# EAGLE design E-P-099-R3.0 (EAGLE 9.0.1)
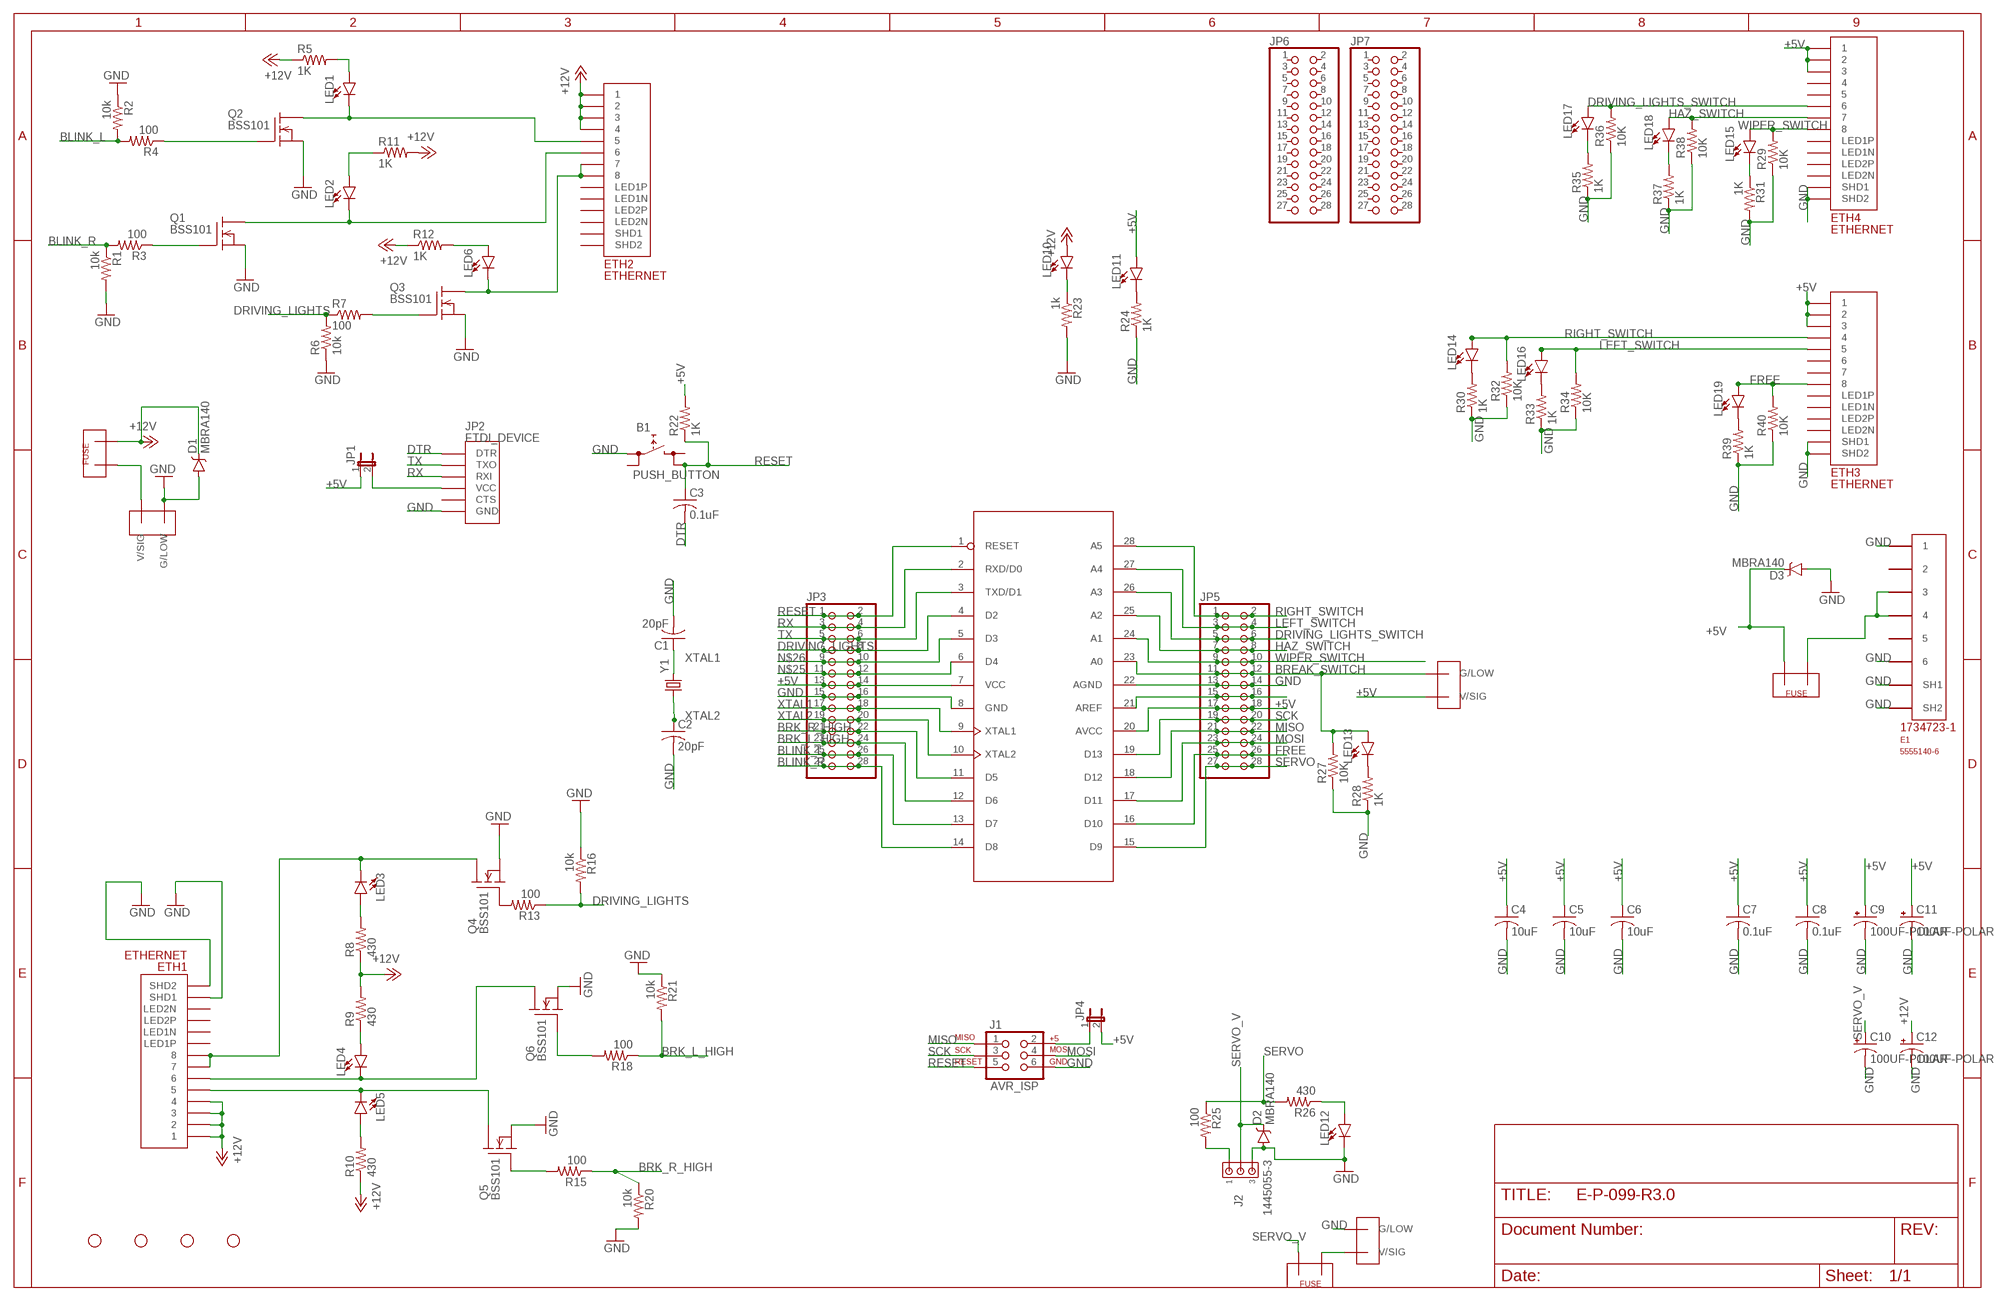
[diagram p0: schematic, sheet 1]

## Parts
AT1  ATMEGA328  [DIP28-0.3IN]
B1  PUSH_BUTTON  [PUSHBUTTON]
C1  20pF  C-USC0805  [C0805]
C2  20pF  C-USC0805  [C0805]
C3  0.1uF  C-USC0805  [C0805]
C4  10uF  C-USC0805  [C0805]
C5  10uF  C-USC0805  [C0805]
C6  10uF  C-USC0805  [C0805]
C7  0.1uF  C-USC0805  [C0805]
C8  0.1uF  C-USC0805  [C0805]
C9  100UF-POLAR  [EEU-FR1H101]
C10  100UF-POLAR  [EEU-FR1H101]
C11  100UF-POLAR  [EEU-FR1H101]
C12  100UF-POLAR  [EEU-FR1H101]
D1  MBRA140  [SMA-DIODE]
D2  MBRA140  [SMA-DIODE]
D3  MBRA140  [SMA-DIODE]
E1  5555140-6  [1734723-1_RJ11]
ETH1  ETHERNET  [A122645-ND]
ETH2  ETHERNET  [A122645-ND]
ETH3  ETHERNET  [A122645-ND]
ETH4  ETHERNET  [A122645-ND]
F1  FUSEMINI-BLADE  [MINI-BLADE-FUSE]
F2  FUSEMINI-BLADE  [MINI-BLADE-FUSE]
F3  FUSEMINI-BLADE  [MINI-BLADE-FUSE]
J1  AVR_ISP  AVR_SPI_PRG_6PTH  [2X3]
J2  1445055-3  [1445055-3]
JP1  JP1E  [JP1]
JP2  FTDI_DEVICE  [FTDI_DEVICE_SIDE]
JP3  PINHD-2X14  [2X14]
JP4  JP1E  [JP1]
JP5  PINHD-2X14  [2X14]
JP6  PINHD-2X14  [2X14]
JP7  PINHD-2X14  [2X14]
LED1  LED0603  [LED-0603]
LED2  LED0603  [LED-0603]
LED3  LED0603  [LED-0603]
LED4  LED0603  [LED-0603]
LED5  LED0603  [LED-0603]
LED6  LED0603  [LED-0603]
LED10  LED0603  [LED-0603]
LED11  LED0603  [LED-0603]
LED12  LED0603  [LED-0603]
LED13  LED0603  [LED-0603]
LED14  LED0603  [LED-0603]
LED15  LED0603  [LED-0603]
LED16  LED0603  [LED-0603]
LED17  LED0603  [LED-0603]
LED18  LED0603  [LED-0603]
LED19  LED0603  [LED-0603]
Q1  BSS101  [TO92]
Q2  BSS101  [TO92]
Q3  BSS101  [TO92]
Q4  BSS101  [TO92]
Q5  BSS101  [TO92]
Q6  BSS101  [TO92]
R1  10k  RESISTOR0805-RES  [0805]
R2  10k  RESISTOR0805-RES  [0805]
R3  100  RESISTOR0805-RES  [0805]
R4  100  RESISTOR0805-RES  [0805]
R5  1K  RESISTOR0805-RES  [0805]
R6  10k  RESISTOR0805-RES  [0805]
R7  100  RESISTOR0805-RES  [0805]
R8  430  RESISTOR0805-RES  [0805]
R9  430  RESISTOR0805-RES  [0805]
R10  430  RESISTOR0805-RES  [0805]
R11  1K  RESISTOR0805-RES  [0805]
R12  1K  RESISTOR0805-RES  [0805]
R13  100  RESISTOR0805-RES  [0805]
R15  100  RESISTOR0805-RES  [0805]
R16  10k  RESISTOR0805-RES  [0805]
R18  100  RESISTOR0805-RES  [0805]
R20  10k  RESISTOR0805-RES  [0805]
R21  10k  RESISTOR0805-RES  [0805]
R22  1K  RESISTOR0805-RES  [0805]
R23  1k  RESISTOR0805-RES  [0805]
R24  1K  RESISTOR0805-RES  [0805]
R25  100  RESISTOR0805-RES  [0805]
R26  430  RESISTOR0805-RES  [0805]
R27  10K  R-US_R0805  [R0805]
R28  1K  RESISTOR0805-RES  [0805]
R29  10K  R-US_R0805  [R0805]
R30  1K  RESISTOR0805-RES  [0805]
R31  1K  RESISTOR0805-RES  [0805]
R32  10K  R-US_R0805  [R0805]
R33  1K  RESISTOR0805-RES  [0805]
R34  10K  R-US_R0805  [R0805]
R35  1K  RESISTOR0805-RES  [0805]
R36  10K  R-US_R0805  [R0805]
R37  1K  RESISTOR0805-RES  [0805]
R38  10K  R-US_R0805  [R0805]
R39  1K  RESISTOR0805-RES  [0805]
R40  10K  R-US_R0805  [R0805]
STANDOFF1  STAND-OFF  [STAND-OFF]
STANDOFF2  STAND-OFF  [STAND-OFF]
STANDOFF3  STAND-OFF  [STAND-OFF]
STANDOFF4  STAND-OFF  [STAND-OFF]
TE1  TE770966  [2X1-MATE-N-LOCK]
TE2  SERVO_PWR  TE770966  [2X1-MATE-N-LOCK]
TE3  TE770966  [2X1-MATE-N-LOCK]
Y1  CRYSTALHC49US  [HC49US]

## Nets
+5V: AT1.7(VCC) AT1.20(AVCC) C4.1 C5.1 C6.1 C7.1 C8.1 C9.P(+) C11.P(+) D3.C ETH3.P$1 ETH3.P$2 ETH3.P$3 ETH4.P$1 ETH4.P$2 ETH4.P$3 F3.OUT JP1.1 JP3.13 JP3.14 JP4.2 JP5.17 JP5.18 LED11.A R22.2 TE3.CIRCUIT1(V/SIG)
+12V: C12.P(+) D1.C ETH1.P$1 ETH1.P$2 ETH1.P$3 ETH1.P$4 ETH2.P$1 ETH2.P$2 ETH2.P$3 ETH2.P$4 F1.OUT LED10.A R5.1 R8.1 R9.2 R10.1 R11.2 R12.1
BLINK_L: AT1.13(D7) JP3.25 JP3.26 R2.2 R4.2
BLINK_R: AT1.14(D8) JP3.27 JP3.28 R1.1 R3.2
BREAK_SWITCH: AT1.23(A0) JP5.11 JP5.12 LED13.A R27.2 TE3.CIRCUIT2(G/LOW)
BRK_L_HIGH: AT1.12(D6) JP3.23 JP3.24 R18.1 R21.2
BRK_R_HIGH: AT1.11(D5) JP3.21 JP3.22 R15.1 R20.1
DRIVING_LIGHTS: AT1.4(D2) JP3.7 JP3.8 R6.2 R7.1 R13.1 R16.2
DRIVING_LIGHTS_SWITCH: AT1.26(A3) ETH4.P$6 JP5.5 JP5.6 LED17.A R36.2
DTR: C3.2 JP2.P$1(DTR)
FREE: AT1.16(D10) ETH3.P$8 JP5.25 JP5.26 LED19.A R40.2
GND: AT1.8(GND) AT1.22(AGND) B1.L1(L) C1.2 C2.2 C4.2 C5.2 C6.2 C7.2 C8.2 C9.G(-) C10.G(-) C11.G(-) C12.G(-) D1.A D2.A D3.A E1.1 E1.6 E1.SH1 E1.SH2 ETH1.P$13(SHD1) ETH1.P$14(SHD2) ETH3.P$13(SHD1) ETH3.P$14(SHD2) ETH4.P$13(SHD1) ETH4.P$14(SHD2) J1.6 J2.3 JP2.P$6(GND) JP3.15 JP3.16 JP5.13 JP5.14 LED12.C Q1.1(S) Q2.1(S) Q3.1(S) Q4.1(S) Q5.1(S) Q6.1(S) R1.2 R2.1 R6.1 R16.1 R20.2 R21.1 R23.2 R24.1 R27.1 R28.1 R29.1 R30.1 R31.2 R32.1 R33.1 R34.1 R35.1 R36.1 R37.1 R38.1 R39.1 R40.1 TE1.CIRCUIT2(G/LOW) TE2.CIRCUIT2(G/LOW)
HAZ_SWITCH: AT1.25(A2) ETH4.P$7 JP5.7 JP5.8 LED18.A R38.2
LEFT_SWITCH: AT1.27(A4) ETH3.P$5 JP5.3 JP5.4 LED16.A R34.2
MISO: AT1.18(D12) J1.1 JP5.21 JP5.22
MOSI: AT1.17(D11) J1.4 JP5.23 JP5.24
N$1: LED14.C R30.2
N$2: LED17.C R35.2
N$3: LED16.C R33.2
N$4: ETH1.P$7 ETH1.P$8 LED3.C Q4.3(D)
N$5: ETH1.P$6 LED4.C Q6.3(D)
N$6: E1.3 E1.4 F3.IN
N$7: ETH1.P$5 LED5.C Q5.3(D)
N$8: Q4.2(G) R13.2
N$9: JP1.2 JP2.P$4(VCC)
N$10: LED19.C R39.2
N$11: LED13.C R28.2
N$12: LED12.A R26.1
N$13: J2.1 R25.2
N$14: Q5.2(G) R15.2
N$15: Q6.2(G) R18.2
N$16: LED10.C R23.1
N$17: Q2.2(G) R4.1
N$18: LED5.A R10.2
N$19: LED11.C R24.2
N$20: ETH2.P$7 ETH2.P$8 LED6.C Q3.3(D)
N$21: ETH2.P$6 LED2.C Q1.3(D)
N$22: ETH2.P$5 LED1.C Q2.3(D)
N$23: LED4.A R9.1
N$25: AT1.6(D4) JP3.11 JP3.12
N$26: AT1.5(D3) JP3.9 JP3.10
N$27: LED3.A R8.2
N$28: LED15.C R31.1
N$29: F2.IN TE2.CIRCUIT1(V/SIG)
N$32: LED1.A R5.2
N$33: Q1.2(G) R3.1
N$34: LED2.A R11.1
N$35: Q3.2(G) R7.2
N$36: LED6.A R12.2
N$37: J1.2 JP4.1
N$46: LED18.C R37.2
N$47: F1.IN TE1.CIRCUIT1(V/SIG)
N$60: AT1.21(AREF) JP5.15 JP5.16
RESET: AT1.1(RESET) B1.R2(R) C3.1 J1.5 JP3.1 JP3.2 R22.1
RIGHT_SWITCH: AT1.28(A5) ETH3.P$4 JP5.1 JP5.2 LED14.A R32.2
RX: AT1.2(RXD/D0) JP2.P$3(RXI) JP3.3 JP3.4
SCK: AT1.19(D13) J1.3 JP5.19 JP5.20
SERVO: AT1.15(D9) JP5.27 JP5.28 R25.1 R26.2
SERVO_V: C10.P(+) D2.C F2.OUT J2.2
TX: AT1.3(TXD/D1) JP2.P$2(TXO) JP3.5 JP3.6
WIPER_SWITCH: AT1.24(A1) ETH4.P$8 JP5.9 JP5.10 LED15.A R29.2
XTAL1: AT1.9(XTAL1) C1.1 JP3.17 JP3.18 Y1.2
XTAL2: AT1.10(XTAL2) C2.1 JP3.19 JP3.20 Y1.1
Unconnected: B1.L2(L) B1.R1(R) E1.2 E1.5 ETH1.P$9(LED1N) ETH1.P$10(LED1P) ETH1.P$11(LED2N) ETH1.P$12(LED2P) ETH2.P$9(LED1N) ETH2.P$10(LED1P) ETH2.P$11(LED2N) ETH2.P$12(LED2P) ETH2.P$13(SHD1) ETH2.P$14(SHD2) ETH3.P$6 ETH3.P$7 ETH3.P$9(LED1N) ETH3.P$10(LED1P) ETH3.P$11(LED2N) ETH3.P$12(LED2P) ETH4.P$4 ETH4.P$5 ETH4.P$9(LED1N) ETH4.P$10(LED1P) ETH4.P$11(LED2N) ETH4.P$12(LED2P) JP2.P$5(CTS) JP6.1 JP6.2 JP6.3 JP6.4 JP6.5 JP6.6 JP6.7 JP6.8 JP6.9 JP6.10 JP6.11 JP6.12 JP6.13 JP6.14 JP6.15 JP6.16 JP6.17 JP6.18 JP6.19 JP6.20 JP6.21 JP6.22 JP6.23 JP6.24 JP6.25 JP6.26 JP6.27 JP6.28 JP7.1 JP7.2 JP7.3 JP7.4 JP7.5 JP7.6 JP7.7 JP7.8 JP7.9 JP7.10 JP7.11 JP7.12 JP7.13 JP7.14 JP7.15 JP7.16 JP7.17 JP7.18 JP7.19 JP7.20 JP7.21 JP7.22 JP7.23 JP7.24 JP7.25 JP7.26 JP7.27 JP7.28

## Library data of the parts
AT1 = atmega328p:ATMEGA328
B1 = PushButton:PUSH_BUTTON
C1-C8 = adafruit:C-US: CAPACITOR, American symbol
C9-C12 = 100uF_Cap:100UF-POLAR: 100µF polarized capacitors A capacitor is a passive two-terminal electrical component used to store electrical energy temporarily in an electric field.
D1-D3 = SparkFun-DiscreteSemi:MBRA140: 40V, 1A Schottky rectifier SMA/DO-214AC package DIO-08053; PROD_ID: DIO-08053
E1 = 5555140-6 RJ11:5555140-6
ETH1-ETH4 = ETHERNET-3:ETHERNET: Ethernet port with 2 leds. digikey number A122645-ND
F1-F3 = Fuse:FUSE
J1 = E-P-099-R2.2:AVR_SPI_PRG_6: AVR ISP 6 Pin This is the reduced ISP connector for AVR programming. Common on Arduino. This footprint will take up less PCB space and can be used with a 10-pin to 6-pin adapter such as SKU: BOB-08508
J2 = con-amp:1445055-3: Micro MATE-N-LOK Connectors grid 1.5 mm Source: ENG_CD_1445055_A.pdf
JP1 JP4 = E-P-099-R2.2:JP1E: JUMPER
JP2 = SparkFun-Connectors:FTDI_DEVICE: Connector which mates to FTDI basic or FTDI cable.
JP3 JP5-JP7 = E-P-099-R2.2:PINHD-2X14: PIN HEADER
LED1-LED6 LED10-LED19 = SparkFun-LED:LED: LED (Generic) Standard schematic elements and footprints for 5mm, 3mm, 1206, and 0603 sized LEDs. Generic LEDs with no color specified.
Q1-Q6 = transistor-fet:BSS101: N-Channel Enhancement MOSFET 200V; 0,16A; 11Ohm
R1-R13 R15 R16 R18 R20-R26 R28 R30 R31 R33 R35 R37 R39 = SparkFun-Passives:RESISTOR: Resistor Basic schematic elements and footprints for 0603, 1206, and PTH resistors.
R27 R29 R32 R34 R36 R38 R40 = resistor:R-US_: RESISTOR, American symbol
STANDOFF1-STANDOFF4 = SparkFun-Electromechanical:STAND-OFF: #4 Stand Off This is the mechanical footprint for a #4 phillips button head screw. Use the keepout ring to avoid running the screw head into surrounding components. SKU : PRT-00447
TE1-TE3 = TwoPinWhiteTEConnector:TE770966
Y1 = SparkFun-FreqCtrl:CRYSTAL: Various standard crystals. Proven footprints.

## Board
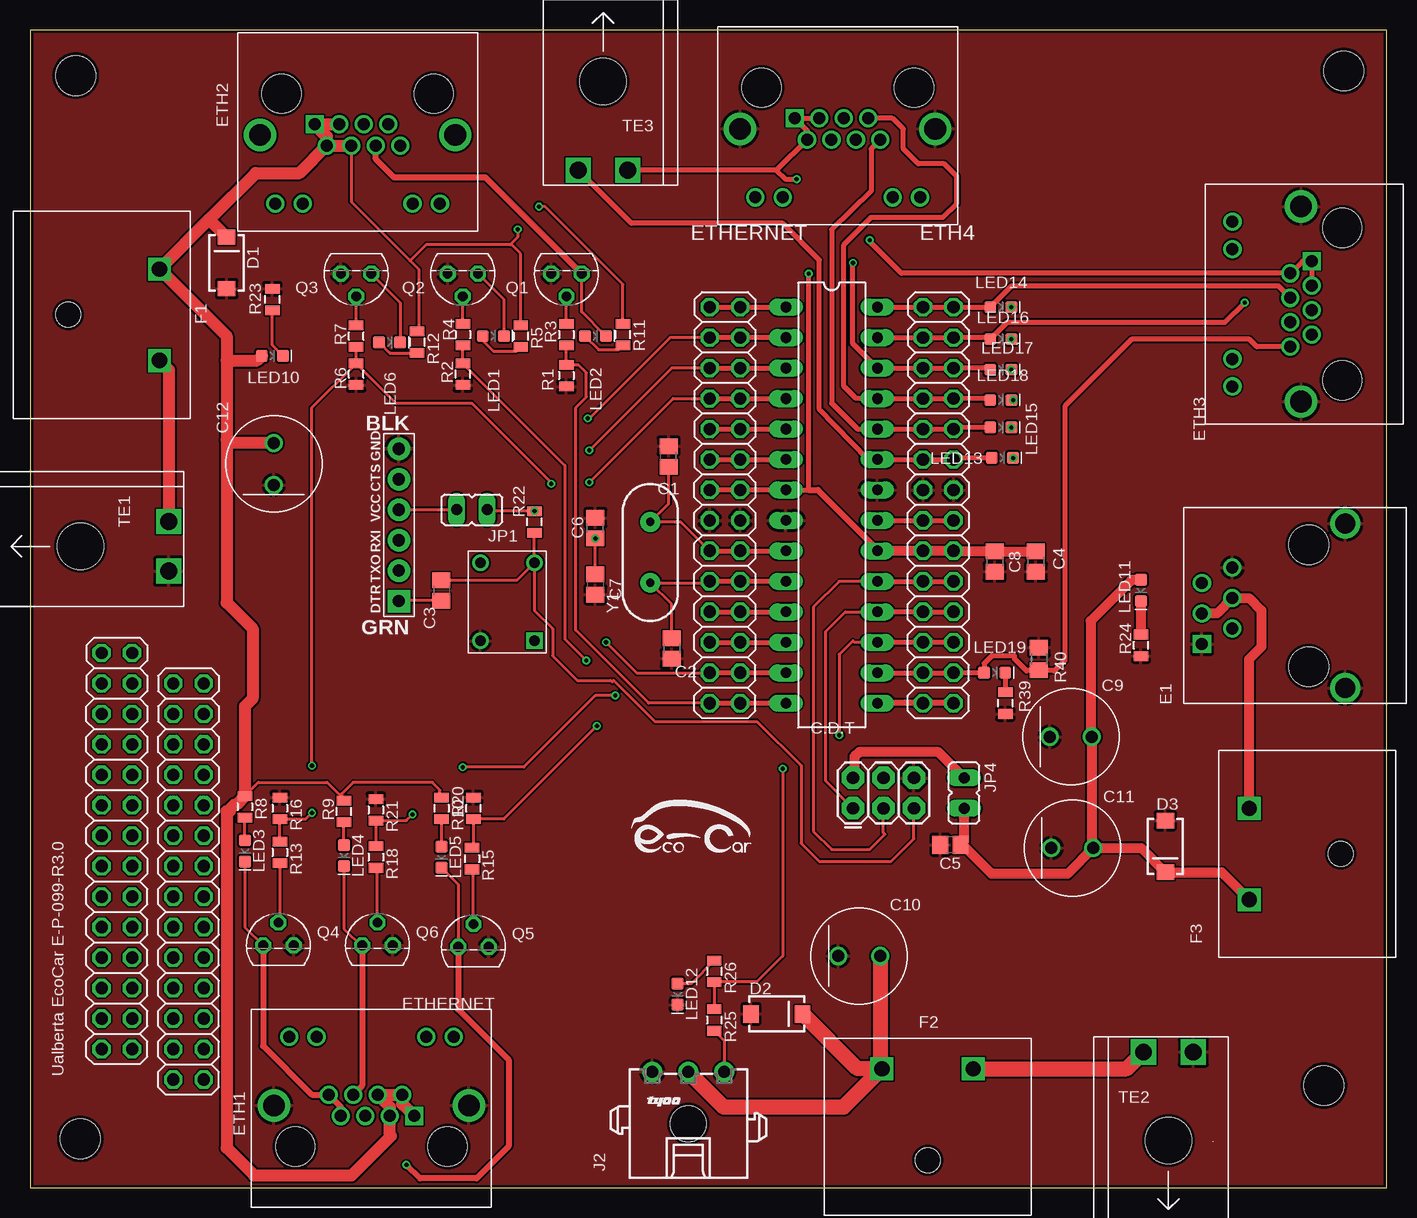
[diagram p1: board, top side]
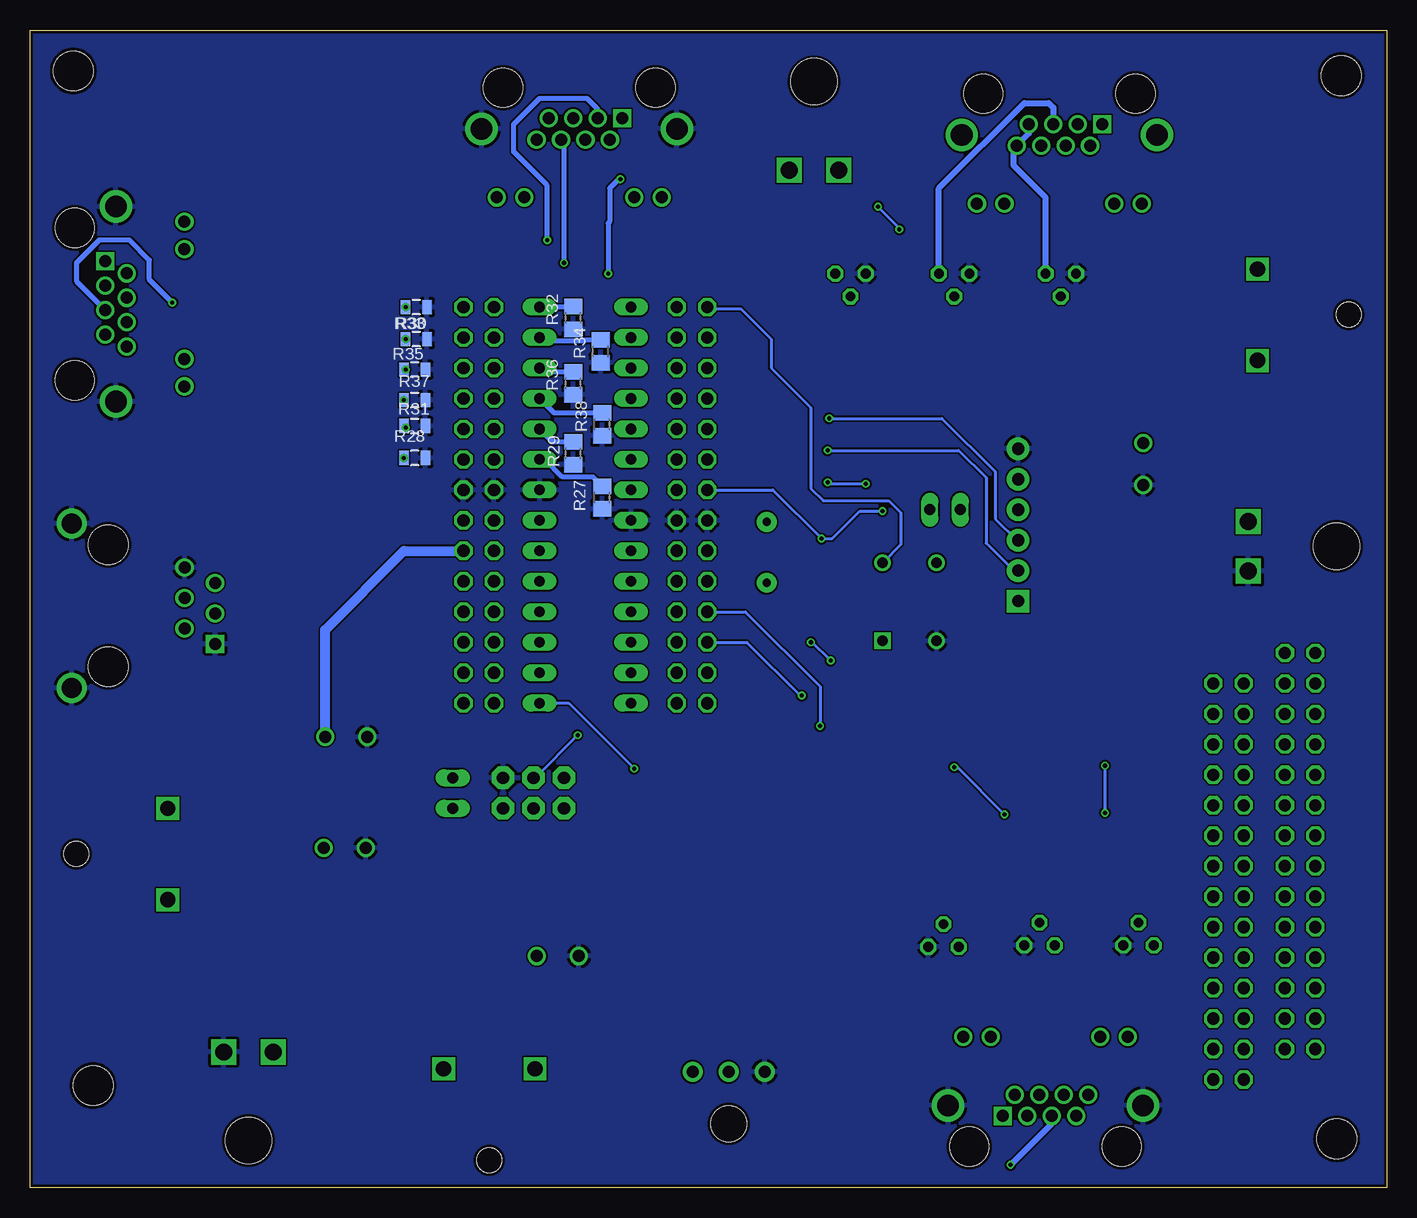
[diagram p2: board, bottom side, seen from below]

Size 113.08 x 96.51 mm. Coordinates in mm from the lower left corner, seen from the top.
Outline: 0,0 113.08,0 113.08,96.51 0,96.51 0,0
Copper layers (1*16): Top 0.035mm / dielectric 1.5mm / Bottom 0.035mm
Design rules "SeeedStudio_2layer_DRU_no_angle_20140221": minimum track width 6mil, minimum drill 12mil, track to track 6mil, track to pad 6mil, pad to pad 6mil, via to via 6mil, smd to smd 0mil, copper to edge 10mil, drill to drill 10mil, minimum pad ring 10mil, minimum via ring 6mil, stop-mask expansion 2mil, vias tented up to drill 100mil, thermal gap 10mil

### Footprints (pad centres in the part's own frame; a part is rotated, then mirrored left to right if it is on the bottom)
DIP28-0.3IN = drill 0.889 long: 1 -16.51,-3.81; 2 -13.97,-3.81; 3 -11.43,-3.81; 4 -8.89,-3.81; 5 -6.35,-3.81; 6 -3.81,-3.81; 7 -1.27,-3.81; 8 1.27,-3.81; 9 3.81,-3.81; 10 6.35,-3.81; 11 8.89,-3.81; 12 11.43,-3.81; 13 13.97,-3.81; 14 16.51,-3.81; 15 16.51,3.81; 16 13.97,3.81; 17 11.43,3.81; 18 8.89,3.81; 19 6.35,3.81; 20 3.81,3.81; 21 1.27,3.81; 22 -1.27,3.81; 23 -3.81,3.81; 24 -6.35,3.81; 25 -8.89,3.81; 26 -11.43,3.81; 27 -13.97,3.81; 28 -16.51,3.81
PUSHBUTTON = drill 0.889: L1 0,4.5; R1 6.5,4.5; R2 6.5,0 | drill 0.889 square: L2 0,0
C0805 = smd 1.3 x 1.5: 1 -0.85,0; 2 0.85,0
EEU-FR1H101 = drill 1: G -1.75,0; P 1.75,0
SMA-DIODE = smd 1.27 x 1.47: A -2.15,0; C 2.15,0
1734723-1_RJ11 = drill 1 square: 1 -3.81,2.54 | drill 1: 2 -2.54,0; 3 -1.27,2.54; 4 0,0; 5 1.27,2.54; 6 2.54,0 | drill 1.65: SH1 -7.5,-9.4; SH2 6.22,-9.4 | hole 3.3: -5.72,-6.35; 4.44,-6.35
A122645-ND = drill 1 square: P$1 3.58,2.54 | drill 1: P$2 2.56,4.32; P$3 1.54,2.54; P$4 0.52,4.32; P$5 -0.5,2.54; P$6 -1.52,4.32; P$7 -2.54,2.54; P$8 -3.56,4.32; P$9 -6.86,9.14; P$10 -4.57,9.14; P$11 4.57,9.14; P$12 6.86,9.14 | drill 1.8: P$13 -8.13,3.43; P$14 8.13,3.43 | hole 3.25: -6.35,0; 6.35,0
MINI-BLADE-FUSE = drill 1.27 square: IN 3.81,7.62; OUT -3.81,7.62 | hole 2.083: 0,0
2X3 = drill 1.016 pad 1.88 octagon: 1 0,0; 2 0,2.54; 3 2.54,0; 4 2.54,2.54; 5 5.08,0; 6 5.08,2.54
1445055-3 = drill 1 pad 1.676: 1 3,4.32; 2 0,4.32; 3 -3,4.32 | hole 3: 0,0
JP1 = drill 0.914 long: 1 0,-1.27; 2 0,1.27
FTDI_DEVICE_SIDE = drill 1.016 pad 1.88 square: P$1 -6.35,0 | drill 1.016 pad 1.88: P$2 -3.81,0; P$3 -1.27,0; P$4 1.27,0; P$5 3.81,0; P$6 6.35,0
2X14 = drill 1.016 octagon: 1 -16.51,-1.27; 2 -16.51,1.27; 3 -13.97,-1.27; 4 -13.97,1.27; 5 -11.43,-1.27; 6 -11.43,1.27; 7 -8.89,-1.27; 8 -8.89,1.27; 9 -6.35,-1.27; 10 -6.35,1.27; 11 -3.81,-1.27; 12 -3.81,1.27; 13 -1.27,-1.27; 14 -1.27,1.27; 15 1.27,-1.27; 16 1.27,1.27; 17 3.81,-1.27; 18 3.81,1.27; 19 6.35,-1.27; 20 6.35,1.27; 21 8.89,-1.27; 22 8.89,1.27; 23 11.43,-1.27; 24 11.43,1.27; 25 13.97,-1.27; 26 13.97,1.27; 27 16.51,-1.27; 28 16.51,1.27
LED-0603 = smd 1 x 1: A -0.877,0; C 0.877,0
TO92 = drill 0.813 octagon: 1 1.27,0; 2 0,1.905; 3 -1.27,0
0805 = smd 0.8 x 1.2: 1 -0.9,0; 2 0.9,0
R0805 = smd 1.3 x 1.5: 1 -0.95,0; 2 0.95,0
STAND-OFF = hole 3.302: 0,0
2X1-MATE-N-LOCK = drill 1.4 square: CIRCUIT1 -2.07,14.23; CIRCUIT2 2.07,14.23 | hole 3.86: 0,6.86
HC49US = drill 0.7 pad 1.651: 1 -2.54,0; 2 2.54,0

### Placement (x,y rotation side)
AT1  66.8,56.9 270 top
B1  42.04,45.59 90 top
C1  53.21,60.96 90 top
C2  53.47,44.96 270 top
C3  34.29,49.78 270 top
C4  83.82,52.2 270 top
C5  76.71,28.57 180 top
C6  47.12,54.99 90 top
C7  47.12,50.29 270 top
C8  80.39,52.2 270 top
C9  86.74,37.59 0 top
C10  69.09,19.3 0 top
C11  86.87,28.32 0 top
C12  20.32,60.33 90 top
D1  16.38,77.09 90 top
D2  62.23,14.48 0 top
D3  94.61,28.45 270 top
E1  100.2,49.15 90 top
ETH1  28.45,3.43 0 top
ETH2  27.3,91.19 180 top
ETH3  109.35,73.66 90 top
ETH4  67.31,91.69 180 top
F1  3.17,72.77 270 top
F2  74.8,2.29 0 top
F3  109.22,27.81 90 top
J1  68.58,31.62 0 top
J2  54.86,5.33 0 top
JP1  36.83,56.52 90 top
JP2  30.73,55.24 90 top
JP3  57.91,56.9 270 top
JP4  77.85,32.89 180 top
JP5  75.69,56.9 270 top
JP6  13.21,25.53 90 top
JP7  7.24,28.07 90 top
LED1  38.61,70.99 0 top
LED2  47.12,70.99 0 top
LED3  17.91,28.07 270 top
LED4  26.16,27.69 270 top
LED5  34.29,27.56 270 top
LED6  29.97,70.48 0 top
LED10  20.19,69.34 0 top
LED11  92.58,49.78 270 top
LED12  53.98,16.13 270 top
LED13  81.03,60.83 0 top
LED14  80.9,73.41 0 top
LED15  80.9,63.37 0 top
LED16  80.9,70.74 0 top
LED17  80.9,68.2 0 top
LED18  80.9,65.66 0 top
LED19  80.39,42.93 0 top
Q1  44.7,76.2 180 top
Q2  36.07,76.2 180 top
Q3  27.18,76.2 180 top
Q4  20.7,20.19 0 top
Q5  36.96,20.07 0 top
Q6  28.96,20.19 0 top
R1  44.7,67.69 270 top
R2  36.07,67.82 90 top
R3  44.7,71.12 270 top
R4  36.07,71.12 270 top
R5  40.89,70.99 270 top
R6  27.18,67.82 90 top
R7  27.18,70.99 90 top
R8  17.91,31.75 270 top
R9  26.16,31.37 90 top
R10  34.29,31.62 270 top
R11  49.4,71.12 90 top
R12  32.26,70.48 270 top
R13  20.83,27.94 270 top
R15  36.83,27.43 270 top
R16  20.83,31.62 270 top
R18  28.83,27.56 270 top
R20  36.96,31.62 90 top
R21  28.83,31.5 270 top
R22  42.04,55.5 90 top
R23  20.19,74.04 90 top
R24  92.58,45.21 90 top
R25  57.02,13.97 270 top
R26  57.02,18.03 270 top
R27  65.41,57.53 90 bottom
R28  81.03,60.83 180 bottom
R29  67.82,61.21 90 bottom
R30  80.9,73.41 180 bottom
R31  81.03,63.5 0 bottom
R32  67.82,72.52 90 bottom
R33  80.9,70.74 180 bottom
R34  65.53,69.72 90 bottom
R35  81.03,68.2 180 bottom
R36  67.82,67.06 90 bottom
R37  81.03,65.66 180 bottom
R38  65.41,63.63 90 bottom
R39  81.28,40.39 90 top
R40  84.07,44.07 270 top
STANDOFF1  107.82,8.51 0 top
STANDOFF2  109.47,93.09 0 top
STANDOFF3  4.19,4.06 0 top
STANDOFF4  3.81,92.71 0 top
TE1  -2.67,53.47 270 top
TE2  94.87,-2.92 0 top
TE3  47.75,99.06 180 top
Y1  51.69,52.96 90 top

### Tracks (layer width: path | path; a pad name or v marks a point on that pad's centre or on a via)
+5V  (via drill 0.35)
  Top 0.254: C7.1 v47.12,54.1 C6.1 | R22.2 38.22,56.4 JP1.1
  Top 0.406: JP3.13 JP3.14 AT1.7 64.9,58.17 v64.9,76.2 | ETH3.P$3 ETH3.P$1 106.05,77.24 ETH3.P$2 72.62,76.22 69.98,78.87 v69.98,78.99 | ETH4.P$3 ETH4.P$1 64.75,88.13 ETH4.P$2 62.21,84.83 | 62.21,84.83 TE3.CIRCUIT1 | 62.21,84.83 62.96,84.07 v63.88,84.07
  Top 0.508: 64.9,58.17 65.66,58.17 70.74,53.09
  Top 0.813: AT1.20 70.74,53.09 JP5.17 JP5.18 80.35,53.09 C8.1 C4.1 | LED11.A 91.81,50.66 88.39,47.24 88.39,37.69 C9.P 88.49,28.45 C11.P | C11.P 92.59,28.32 D3.C 99.31,26.3 F3.OUT | C11.P 86.46,26.16 80.14,26.16 77.72,28.57 C5.1 77.85,28.87 JP4.2
  Bottom 0.254: JP3.13 51.18,58.17 v47.12,54.1 46.23,54.1 43.93,56.4 R22.2
  Bottom 0.406: 69.47,53.34 AT1.20 | v64.9,76.2 64.9,80.39 64.77,80.52 64.77,83.31 64.01,84.07 v63.88,84.07 | v69.98,78.99 69.98,83.57 72.77,86.36 72.77,88.65 70.61,90.81 66.67,90.81 65.77,89.9 ETH4.P$3
  Bottom 0.813: C9.P 88.49,46.51 81.92,53.09 JP5.18
  other vias: 42.04,56.4
+12V  (via drill 0.35)
  Top 0.254: ETH2.P$4 26.79,82.18 31.69,77.28 | 31.69,77.28 32.38,76.58 32.38,71.51 R12.1 | R5.1 40.89,77.85 40.13,78.61 40.01,78.61 | 40.01,78.61 33.02,78.61 31.69,77.28 | R11.2 49.4,75.31 42.93,81.79 v42.42,81.79 | v40.64,79.88 40.64,79.25 40.01,78.61 | R8.1 19.04,33.78 24.77,33.78 25.78,32.77 25.91,32.77 25.97,32.7 | 25.97,32.7 26.16,32.51 R9.2 | R10.1 34.16,32.65 34.16,33.15 33.53,33.78 26.92,33.78 25.97,32.83 25.97,32.7
  Top 1.016: 14.99,80.77 F1.OUT 16.38,70.99 16.38,68.96 | 14.99,80.77 18.8,84.58 22.46,84.58 ETH2.P$2 | ETH2.P$2 24.75,87.63 ETH2.P$1 ETH2.P$3 | ETH2.P$2 ETH2.P$4 | D1.C 14.99,80.64 14.99,80.77 | 16.38,68.96 16.38,62.36 | 16.38,62.36 16.38,48.77 18.54,46.61 18.54,40.77 17.91,40.13 R8.1 17.17,31.91 17.03,31.91 16.65,31.52 16.65,31.39 16.63,31.37 16.38,31.37 16.38,3.3 18.67,1.02 26.8,1.02 30.1,4.32 29.99,4.43 ETH1.P$3 29.99,6.73 ETH1.P$4 ETH1.P$2 31.01,6.99 ETH1.P$1 | 16.38,68.96 18.93,68.96 LED10.A | C12.P 16.66,62.08 16.38,62.36
  Bottom 0.254: v42.42,81.79 40.64,80.01 v40.64,79.88
BLINK_L  (via drill 0.35)
  Top 0.254: R4.2 R2.2 44.58,60.21 44.58,45.72 v46.35,43.94 | v48.01,45.47 50.55,42.93 JP3.25
  Top 0.406: AT1.13 JP3.26 JP3.25
  Bottom 0.254: v46.35,43.94 47.88,45.47 v48.01,45.47
BLINK_R
  Top 0.254: R3.2 R1.1 45.71,68.59 46.35,67.94 46.35,65.91 45.47,65.02 45.47,46.48 51.56,40.39 JP3.27
  Top 0.305: AT1.14 62.99,40.81
  Top 0.406: JP3.27 JP3.28 AT1.14
BREAK_SWITCH
  Top 0.406: 76.71,60.71 JP5.11 AT1.23 69.85,60.71 65.79,64.9 65.79,77.34 62.74,80.39 50.12,80.39 TE3.CIRCUIT2 | 76.71,60.71 JP5.12 | LED13.A 76.83,60.83 76.71,60.71
  Bottom 0.406: R27.2 66.18,59.26 68.72,59.26 70.16,60.71 AT1.23
BRK_L_HIGH  (via drill 0.35)
  Top 0.254: v31.88,31.11 31.36,30.6 R21.2 R18.1 | v48.77,41.02 47.12,41.02 41.15,35.05 v36.07,35.05
  Top 0.406: JP3.23 JP3.24 AT1.12
  Bottom 0.254: JP3.23 53.34,45.47 48.9,41.02 v48.77,41.02 | v36.07,35.05 35.81,35.05 v31.88,31.11
BRK_R_HIGH  (via drill 0.35)
  Top 0.254: R15.1 36.96,28.46 R20.1 39.49,30.72 v47.24,38.48
  Top 0.406: JP3.21 JP3.22 AT1.11
  Bottom 0.254: JP3.21 53.47,48.01 47.24,41.78 v47.24,38.48
DRIVING_LIGHTS  (via drill 0.35)
  Top 0.254: R6.2 R7.1 | R13.1 R16.2 22.98,30.72 v23.5,31.24 | v23.5,35.18 23.5,65.03 R6.2 | R6.2 30.49,65.41 36.83,65.41 43.43,58.8 v43.43,58.67 | v46.61,58.8 53.59,65.79 JP3.7
  Top 0.406: JP3.7 JP3.8 AT1.4
  Bottom 0.254: v23.5,31.24 v23.5,35.18 | v43.43,58.67 46.48,58.67 v46.61,58.8
  Bottom 0.305: 56.52,65.66 JP3.7
DRIVING_LIGHTS_SWITCH  (via drill 0.35)
  Top 0.406: LED17.A 79.89,68.33 JP5.6 JP5.5 AT1.26 68.58,70.36 v68.58,77.09
  Bottom 0.406: R36.2 70.29,68.01 AT1.26 | v68.58,77.09 68.58,87.12 ETH4.P$6
DTR
  Top 0.254: C3.2 30.77,48.93 JP2.P$1
FREE
  Top 0.406: AT1.16 JP5.25 JP5.26 LED19.A 79.51,43.7 80.14,44.32 82.04,44.32 82.04,44.07 83.06,43.05 83.12,43.12 R40.2 85.28,43.12 85.34,43.05 86.23,43.94 86.23,65.15 91.82,70.74 101.6,70.74 102.24,70.1 ETH3.P$8
GND
  pour Bottom (rank 5): 0,96.52 113.03,96.52 113.03,0 0,0
  pour Top: -2.41,-1.65 -2.41,99.69 114.05,99.69 114.17,99.82 114.17,-1.65 114.05,-1.78 -2.29,-1.78
HAZ_SWITCH
  Top 0.406: LED18.A 79.89,65.79 JP5.8 JP5.7 AT1.25 68.83,65.79 67.82,66.8 67.82,78.61 70.1,80.9 76.07,80.9 77.22,82.04 77.22,84.33 76.2,85.34 74.04,85.34 72.77,86.61 72.77,88.27 71.88,89.15 ETH4.P$7
  Bottom 0.406: R38.2 69.4,64.58 AT1.25
LEFT_SWITCH  (via drill 0.35)
  Top 0.406: AT1.27 JP5.3 JP5.4 79.89,70.87 LED16.A 81.42,72.14 99.57,72.14 v101.22,73.79
  Bottom 0.406: R34.2 66.81,70.67 66.92,70.56 70.31,70.56 AT1.27 | v101.22,73.79 103.12,75.69 103.12,77.34 104.78,78.99 107.31,78.99 109.22,77.09 109.22,75.57 ETH3.P$5
MISO
  Top 0.254: J1.1 66.29,33.91 66.29,46.35 67.94,48.01 AT1.18
  Top 0.305: 70.61,47.88 AT1.18
  Top 0.406: JP5.22 JP5.21 AT1.18
MOSI  (via drill 0.35)
  Top 0.254: AT1.17 68.71,45.47 68.58,45.59 67.44,44.45 v67.44,37.72
  Top 0.406: JP5.24 JP5.23 AT1.17
  Bottom 0.254: v67.44,37.72 70.99,34.16 J1.4
N$1  (via drill 0.35)
  Bottom 0.406: R30.2 LED14.C
  other vias: 81.78,73.41
N$2  (via drill 0.35)
  Bottom 0.406: R35.2 LED17.C
  other vias: 81.78,68.2
N$3  (via drill 0.35)
  Bottom 0.406: LED16.C R33.2
  other vias: 81.78,70.74
N$4
  Top 0.254: LED3.C 17.91,21.72 Q4.3
  Top 0.508: Q4.3 19.43,11.81 23.49,7.75 ETH1.P$8 25.91,6.73 ETH1.P$7
N$5
  Top 0.254: LED4.C 26.16,21.59 27.69,20.07
  Top 0.508: Q6.3 27.69,20.07 27.69,8.51 ETH1.P$6
N$6
  Top 0.813: F3.IN 101.6,44.07 102.62,45.09 102.62,48.13 101.6,49.15 E1.4 98.93,47.88 E1.3
N$7  (via drill 0.35)
  Top 0.254: LED5.C 35.69,25.29 Q5.3
  Top 0.508: Q5.3 35.69,14.86 39.88,10.67 39.88,3.43 37.21,0.76 32.51,0.76 v31.37,1.91
  Bottom 0.508: v31.37,1.91 27.95,5.33 ETH1.P$5
N$8
  Top 0.254: R13.2 20.83,22.23 Q4.2
N$9
  Top 0.254: JP2.P$4 JP1.2
N$10
  Top 0.406: LED19.C 81.28,42.91 R39.2
N$11  (via drill 0.35)
  Top 0.406: LED13.C R28.2
  other vias: 81.93,60.83
N$12
  Top 0.254: R26.1 55.09,17.01 LED12.A
N$13
  Top 0.254: R25.2 57.86,12.23 J2.1
N$14
  Top 0.254: Q5.2 36.96,26.41 R15.2
N$15
  Top 0.254: Q6.2 28.96,26.53 R18.2
N$16
  Top 0.254: LED10.C 20.19,70.22 R23.1
N$17
  Top 0.254: R4.1 Q2.2
N$18
  Top 0.254: R10.2 LED5.A
N$19
  Top 0.813: LED11.C R24.2
N$20
  Top 0.254: Q3.3 30.85,73.8 LED6.C
  Bottom 0.508: Q3.3 28.45,82.55 31.11,85.22 31.11,86.62 ETH2.P$8 29.84,87.89 ETH2.P$7
N$21
  Top 0.254: LED2.C 45.97,73.01 Q1.3
  Top 0.508: Q1.3 37.97,84.2 30.35,84.2 28.82,85.73 ETH2.P$6
N$22
  Top 0.254: Q2.3 39.48,74.05 LED1.C
  Bottom 0.508: Q2.3 37.34,83.31 30.23,90.42 28.19,90.42 27.8,90.03 ETH2.P$5
N$23
  Top 0.254: LED4.A R9.1
N$25
  Top 0.406: JP3.11 JP3.12 AT1.6
N$26
  Top 0.406: JP3.9 JP3.10 AT1.5
N$27
  Top 0.254: LED3.A R8.2
N$28  (via drill 0.35)
  Bottom 0.406: R31.1 81.9,63.5 LED15.C
  other vias: 81.78,63.37
N$29
  Top 1.27: F2.IN 91.4,9.91 TE2.CIRCUIT1
N$32
  Top 0.254: LED1.A 37.73,70.6 38.61,69.72 40.52,69.72 R5.2
N$33
  Top 0.254: R3.1 Q1.2
N$34
  Top 0.254: LED2.A 47.38,69.85 49.03,69.85 R11.1
N$35
  Top 0.254: R7.2 Q3.2
N$36
  Top 0.254: LED6.A 30,69.58 R12.2
N$37
  Top 0.813: JP4.1 75.69,36.32 69.09,36.32 68.71,35.94 68.71,34.29 J1.2
N$46  (via drill 0.35)
  Top 0.406: LED18.C R37.2
  other vias: 81.93,65.66
N$47
  Top 1.016: F1.IN 11.56,68.19 TE1.CIRCUIT1
N$60
  Top 0.406: AT1.21 JP5.15 JP5.16
RESET
  Top 0.254: B1.R2 R22.1 | B1.R2 40.58,50.63 C3.1 | B1.R2 42.04,48.13 43.56,46.61 43.56,44.32 45.59,42.29 48.39,42.29 48.51,42.16 48.64,42.29 52.07,38.86 60.58,38.86 64.26,35.18 64.26,28.7 65.79,27.18 71.75,27.18 73.66,29.08 J1.5
  Top 0.406: JP3.1 JP3.2 AT1.1
  Bottom 0.254: JP3.1 56.52,73.28 53.85,73.28 51.31,70.74 51.31,68.33 48.01,65.02 48.01,58.29 46.99,57.28 41.53,57.28 40.51,56.26 40.51,53.62 B1.R2
RIGHT_SWITCH
  Top 0.406: AT1.28 JP5.1 JP5.2 LED14.A 81.8,75.18 104.02,75.18 ETH3.P$4
  Bottom 0.406: R32.2 67.88,73.41 AT1.28
RX  (via drill 0.35)
  Top 0.254: JP3.3 53.34,70.87 46.61,64.14 v46.48,64.14
  Top 0.406: AT1.2 JP3.4 JP3.3
  Bottom 0.254: v46.48,64.14 37.08,64.14 32.64,59.69 32.64,55.75 30.86,53.98 JP2.P$3
  Bottom 0.305: 56.52,70.99 JP3.3
SCK
  Top 0.254: AT1.19 67.44,50.55 65.28,48.39 65.28,29.72 66.8,28.19 69.98,28.19 71.25,29.46 71.12,29.59 J1.3
  Top 0.406: AT1.19 JP5.19 JP5.20
SERVO  (via drill 0.35)
  Top 0.254: v62.74,34.92 62.74,19.3 60.58,17.14 57.03,17.14 R26.2 R25.1
  Top 0.508: JP5.28 JP5.27 AT1.15
  Bottom 0.254: AT1.15 68.2,40.39 62.87,35.05 62.74,35.05 v62.74,34.92
SERVO_V
  Top 1.27: J2.2 57.79,6.73 67.82,6.73 F2.OUT | F2.OUT 68.95,9.91 D2.C | C10.P 70.84,10.06 F2.OUT
TX  (via drill 0.35)
  Top 0.254: JP3.5 53.47,68.33 v46.61,61.47
  Top 0.406: JP3.5 JP3.6 AT1.3
  Bottom 0.254: v46.61,61.47 35.69,61.47 33.4,59.18 33.4,53.72 31.11,51.44 JP2.P$2
WIPER_SWITCH
  Top 0.406: LED15.A 77.09,63.37 JP5.10 JP5.9 AT1.24 68.96,63.25 66.8,65.41 66.8,79.88 70.1,83.06 70.1,86.61 ETH4.P$8
  Bottom 0.406: R29.2 69.53,62.16 AT1.24
XTAL1
  Top 0.254: JP3.17 54.23,55.5 Y1.2 53.21,57.02 C1.1
  Top 0.406: JP3.17 JP3.18 AT1.9
  Bottom 0.305: 62.56,53.09 AT1.9
XTAL2
  Top 0.254: C2.1 53.47,48.64 Y1.1 56.52,50.42 JP3.19
  Top 0.406: AT1.10 JP3.20 JP3.19

### Text on the board
tPlace: C.D.T | Ualberta EcoCar E-P-099-R3.0